# EAGLE design Nikon_PowerBoardV1 (EAGLE 7.3.0)
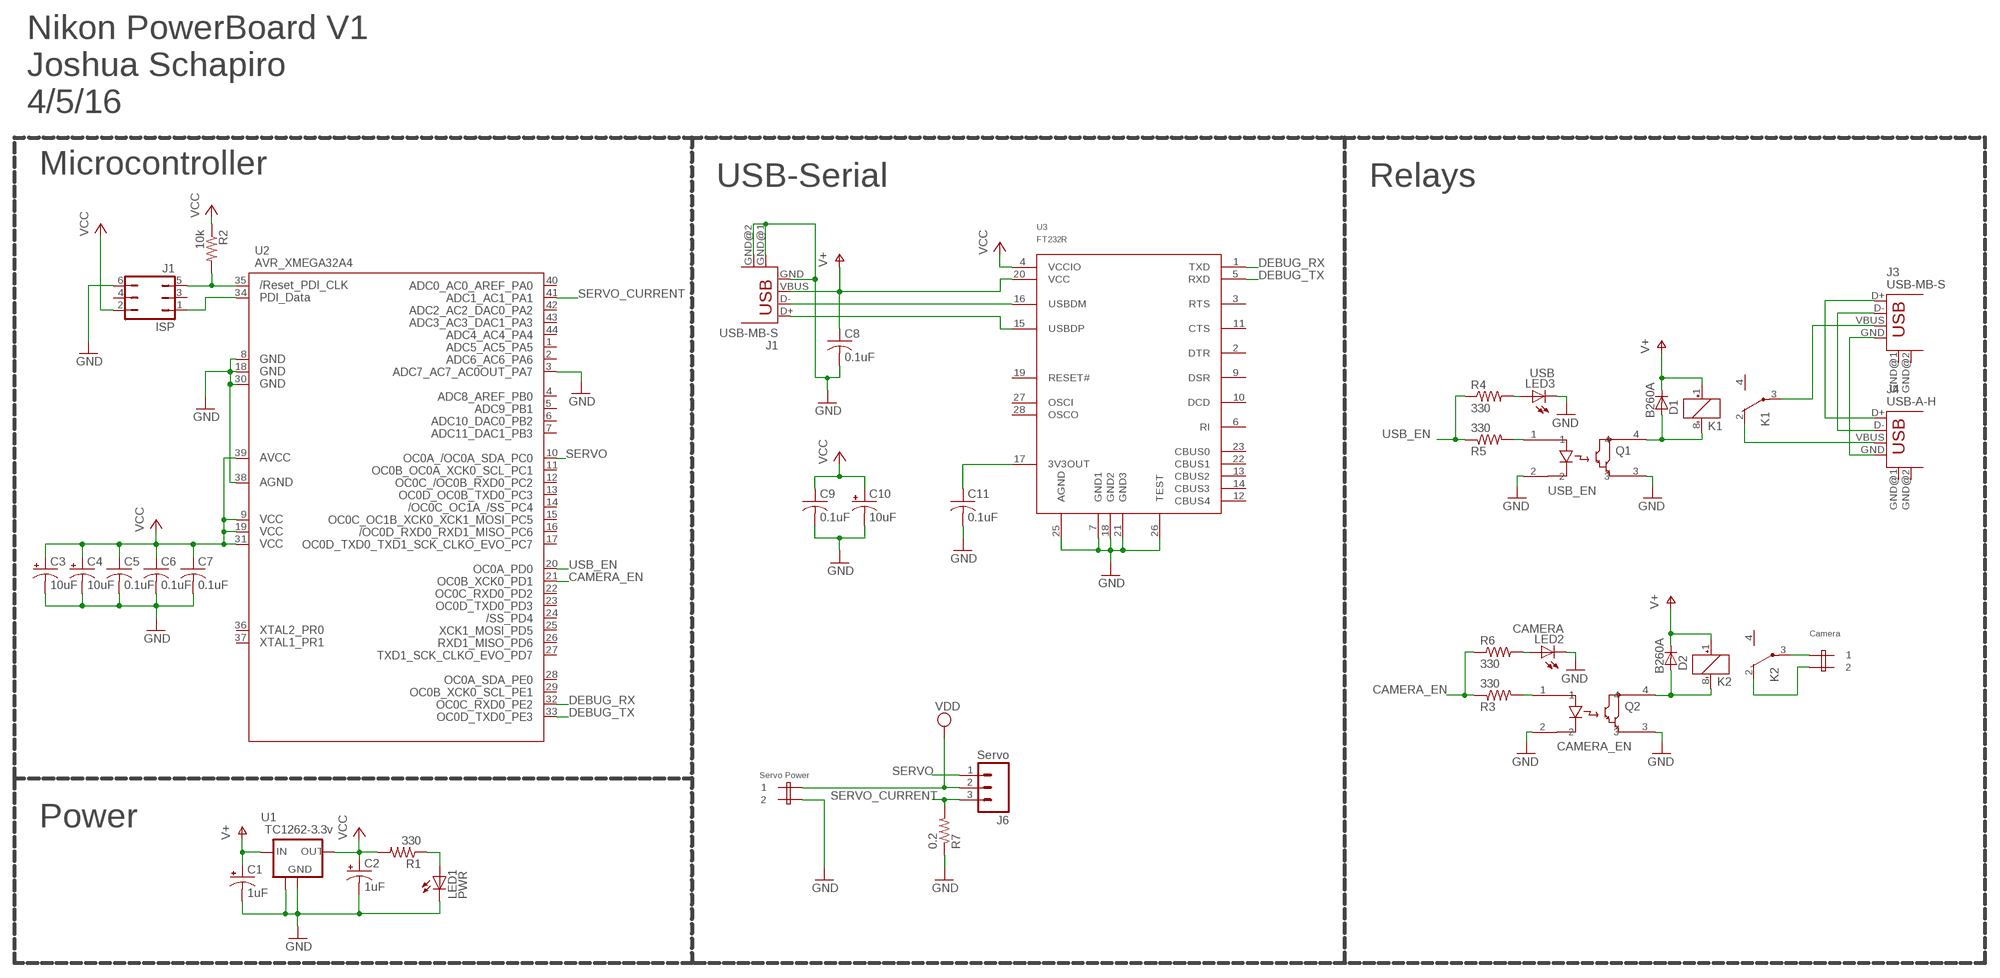
[diagram p0: schematic, sheet 1]

## Parts
C1  1uF  CAP_POL1206  [EIA3216]
C2  1uF  CAP_POL1206  [EIA3216]
C3  10uF  CAP_POL1206  [EIA3216]
C4  10uF  CAP_POL1206  [EIA3216]
C5  0.1uF  C-USC1206  [C1206]
C6  0.1uF  C-USC1206  [C1206]
C7  0.1uF  C-USC1206  [C1206]
C8  0.1uF  C-USC1206  [C1206]
C9  0.1uF  C-USC1206  [C1206]
C10  10uF  CAP_POL1206  [EIA3216]
C11  0.1uF  C-USC1206  [C1206]
D1  B260A  DIODESMA  [SMA-DIODE]
D2  B260A  DIODESMA  [SMA-DIODE]
ISP  J1  JP3Q  [JP3Q]
J1  USB-MB-S  [USB-MB-S]
J2  Camera  2-PIN_SCREWTERMINAL  [2-PIN_SCREWTERM]
J3  USB-MB-S  [USB-MB-S]
J4  USB-A-H  [USB-A-H]
J5  ServoPower  2-PIN_SCREWTERMINAL  [2-PIN_SCREWTERM]
J6  Servo  M03LONGPADS  [1X03_LONGPADS]
K1  USB_EN  G6K-2F  [G6K-2F]
K2  CAMERA_EN  G6K-2F  [G6K-2F]
LED1  PWR  LEDCHIPLED_1206  [CHIPLED_1206]
LED2  CAMERA  LEDCHIPLED_1206  [CHIPLED_1206]
LED3  USB  LEDCHIPLED_1206  [CHIPLED_1206]
Q1  USB_EN  OPTOISOLATOR_SINGLE  [4-PIN_MINI-FLAT]
Q2  CAMERA_EN  OPTOISOLATOR_SINGLE  [4-PIN_MINI-FLAT]
R1  330  R-US_R1206  [R1206]
R2  10k  R-US_R1206  [R1206]
R3  330  R-US_R1206  [R1206]
R4  330  R-US_R1206  [R1206]
R5  330  R-US_R1206  [R1206]
R6  330  R-US_R1206  [R1206]
R7  0.2  R-US_R1206  [R1206]
U1  TC1262-3.3v  REGULATOR  [SOT223]
U2  AVR_XMEGA32A4  AVR_XMEGA_A4_44A  [TQFP44]
U3  FT232R  [SSOP28]

## Nets
CAMERA_EN: R3.1 R6.1 U2.21(PD1)
DEBUG_RX: U2.32(PE2) U3.1(TXD)
DEBUG_TX: U2.33(PE3) U3.5(RXD)
GND: C1.C(-) C2.C(-) C3.C(-) C4.C(-) C5.2 C6.2 C7.2 C8.2 C9.2 C10.C(-) C11.2 ISP.6 J1.GND J1.GND@1(GND) J1.GND@2(GND) J5.P$2 LED1.C LED2.C LED3.C Q1.2 Q1.3 Q2.2 Q2.3 R7.1 U1.2(GND) U1.4(GND1) U2.3(PA7) U2.8(GND1) U2.18(GND2) U2.30(GND3) U2.38(AGND) U3.7(GND1) U3.18(GND2) U3.21(GND3) U3.25(AGND) U3.26(TEST)
J2: J3.D+ J4.D+
N$1: ISP.1 U2.34(PDI_DATA)
N$2: J3.GND J4.GND
N$3: J3.D- J4.D-
N$4: LED1.A R1.1
N$5: Q1.1 R5.2
N$6: ISP.5 R2.2 U2.35(RESET)
N$7: D2.A K2.8(1:-) Q2.4
N$8: J3.VBUS K1.3(2:P)
N$9: J4.VBUS K1.2(2:O)
N$10: LED3.A R4.2
N$11: Q2.1 R3.2
N$12: J1.D- U3.16(USBDM)
N$13: J1.D+ U3.15(USBDP)
N$14: J2.P$1 K2.3(2:P)
N$15: J2.P$2 K2.2(2:O)
N$18: C11.1 U3.17(3V3OUT)
N$19: LED2.A R6.2
N$180: D1.A K1.8(1:-) Q1.4
SERVO: J6.1 U2.10(PC0)
SERVO_CURRENT: J6.3 R7.2 U2.41(PA1)
USB_EN: R4.1 R5.1 U2.20(PD0)
V+: C1.A(+) C8.1 D1.C D2.C J1.VBUS K1.1(1:+) K2.1(1:+) U1.1(IN) U3.20(VCC)
VCC: C2.A(+) C3.A(+) C4.A(+) C5.1 C6.1 C7.1 C9.1 C10.A(+) ISP.2 R1.2 R2.1 U1.3(OUT) U2.9(VCC1) U2.19(VCC2) U2.31(VCC3) U2.39(AVCC) U3.4(VCCIO)
VDD: J5.P$1 J6.2
Unconnected: ISP.3 ISP.4 J3.GND@1(GND) J3.GND@2(GND) J4.GND@1(GND) J4.GND@2(GND) K1.4(2:S) K1.5(3:S) K1.6(3:P) K1.7(3:O) K2.4(2:S) K2.5(3:S) K2.6(3:P) K2.7(3:O) U2.1(PA5) U2.2(PA6) U2.4(PB0) U2.5(PB1) U2.6(PB2) U2.7(PB3) U2.11(PC1) U2.12(PC2) U2.13(PC3) U2.14(PC4) U2.15(PC5) U2.16(PC6) U2.17(PC7) U2.22(PD2) U2.23(PD3) U2.24(PD4) U2.25(PD5) U2.26(PD6) U2.27(PD7) U2.28(PE0) U2.29(PE1) U2.36(PR0) U2.37(PR1) U2.40(PA0) U2.42(PA2) U2.43(PA3) U2.44(PA4) U3.2(DTR) U3.3(RTS) U3.6(RI) U3.9(DSR) U3.10(DCD) U3.11(CTS) U3.12(CBUS4) U3.13(CBUS2) U3.14(CBUS3) U3.19(RESET#) U3.22(CBUS1) U3.23(CBUS0) U3.27(OSCI) U3.28(OSCO)

## Notes on the sheet
- Nikon PowerBoard V1
  Joshua Schapiro
  4/5/16
- Microcontroller
- USB-Serial | Relays
- Camera
- Servo Power
- Power

## Library data of the parts
C1-C4 C10 = SparkFun:CAP_POL: Capacitor Polarized These are standard SMD and PTH capacitors. Normally 10uF, 47uF, and 100uF in electrolytic and tantalum varieties. Always verify the external diameter of the through hole cap, it varies with capacity, voltage, and manufacturer. The EIA devices should be standard.
C5-C9 C11 = resistor:C-US: CAPACITOR, American symbol
D1 D2 = SparkFun:DIODE: Diode These are standard reverse protection diodes and small signal diodes. SMA package can handle up to about 1A. SOD-323 can handle about 200mA. What the SOD-323 package when ordering, there are some mfgs out there that are 5-pin packages.
ISP = jumper:JP3Q: JUMPER
J1 J3 J4 = GadgetOne:USB: USB Connectors
J2 J5 = Josh:2-PIN_SCREWTERMINAL
J6 = SparkFun:M03: Header 3 Standard 3-pin 0.1" header. Use with straight break away headers (SKU : PRT-00116), right angle break away headers (PRT-00553), swiss pins (PRT-00743), machine pins (PRT-00117), and female headers (PRT-00115). Molex polarized connector foot print use with SKU : PRT-08232 with associated crimp pins and housings.
K1 K2 = relay:G6K: Low Signal Relay oeiwcsnts1.omron.com/.. D20G6K0100.pdf
LED1-LED3 = led:LED: LED OSRAM: - CHIPLED LG R971, LG N971, LY N971, LG Q971, LY Q971, LO R971, LY R971 LH N974, LH R974 LS Q976, LO Q976, LY Q976 LO Q996 - Hyper CHIPLED LW Q18S LB Q993, LB Q99A, LB R99A - SideLED LS A670, LO A670, LY A670, LG A670, LP A670 LB A673, LV A673, LT A673, LW A673 LH A674 LY A675 LS A676, LA A676, LO A676, LY A676, LW A676 LS A679, LY A679, LG A679 - Hyper Micro SIDELED® LS Y876, LA Y876, LO Y876, LY Y876 LT Y87S - SmartLED LW L88C, LW L88S LB L89C, LB L89S, LG L890 LS L89K, LO L89K, LY L89K LS L896, LA L896, LO L896, LY L896 - TOPLED LS T670, LO T670, LY T670, LG T670, LP T670 LSG T670, LSP T670, LSY T670, LOP T670, LYG T670 LG T671, LOG T671, LSG T671 LB T673, LV T673, LT T673, LW T673 LH T674 LS T676, LA T676, LO T676, LY T676, LB T676, LH T676, LSB T676, LW T676 LB T67C, LV T67C, LT T67C, LS T67K, LO T67K, LY T67K, LW E67C LS E67B, LA E67B, LO E67B, LY E67B, LB E67C, LV E67C, LT E67C LW T67C LS T679, LY T679, LG T679 LS T770, LO T770, LY T770, LG T770, LP T770 LB T773, LV T773, LT T773, LW T773 LH T774 LS E675, LA E675, LY E675, LS T675 LS T776, LA T776, LO T776, LY T776, LB T776 LHGB T686 LT T68C, LB T68C - Hyper Mini TOPLED® LB M676 - Mini TOPLED Santana® LG M470 LS M47K, LO M47K, LY M47K Source: http://www.osram.convergy.de LUXEON: - LUMILED® LXK2-PW12-R00, LXK2-PW12-S00, LXK2-PW14-U00, LXK2-PW14-V00 LXK2-PM12-R00, LXK2-PM12-S00, LXK2-PM14-U00 LXK2-PE12-Q00, LXK2-PE12-R00, LXK2-PE12-S00, LXK2-PE14-T00, LXK2-PE14-U00 LXK2-PB12-K00, LXK2-PB12-L00, LXK2-PB12-M00, LXK2-PB14-N00, LXK2-PB14-P00, LXK2-PB14-Q00 LXK2-PR12-L00, LXK2-PR12-M00, LXK2-PR14-Q00, LXK2-PR14-R00 LXK2-PD12-Q00, LXK2-PD12-R00, LXK2-PD12-S00 LXK2-PH12-R00, LXK2-PH12-S00 LXK2-PL12-P00, LXK2-PL12-Q00, LXK2-PL12-R00 Source: www.luxeon.com KINGBRIGHT: KA-3528ASYC Source: www.kingbright.com
Q1 Q2 = Josh:OPTOISOLATOR_SINGLE: Digikey: 425-2098-1-ND If = 10ma Ic = 80ma
R1-R7 = resistor:R-US_: RESISTOR, American symbol
U1 = GadgetOne:REGULATOR: VOLTAGE REGULATOR, see: http://focus.ti.com/lit/ds/symlink/ua78m05.pdf
U2 = xmega:AVR_XMEGA_A4_: Device for Atmel AVR XMEGA A4 Series
U3 = gadgetry:FT232R

## Net classes
4 xxwide: width 0.203 mm

## Board
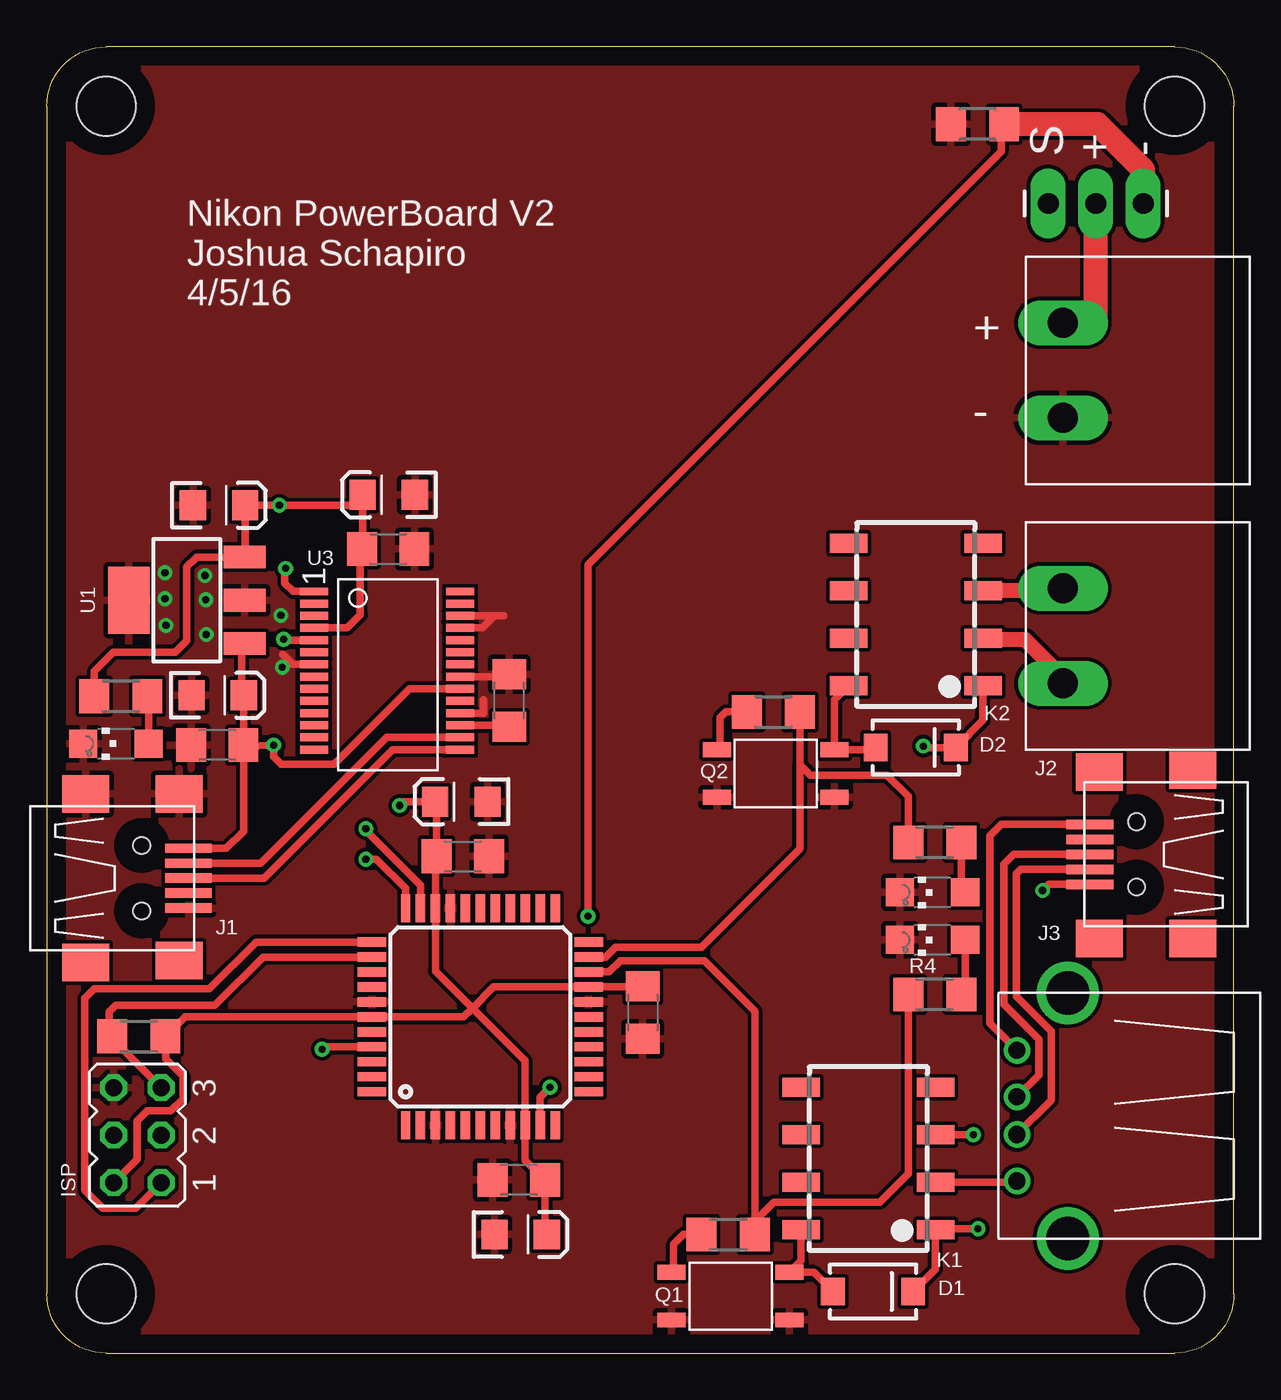
[diagram p1: board, top side]
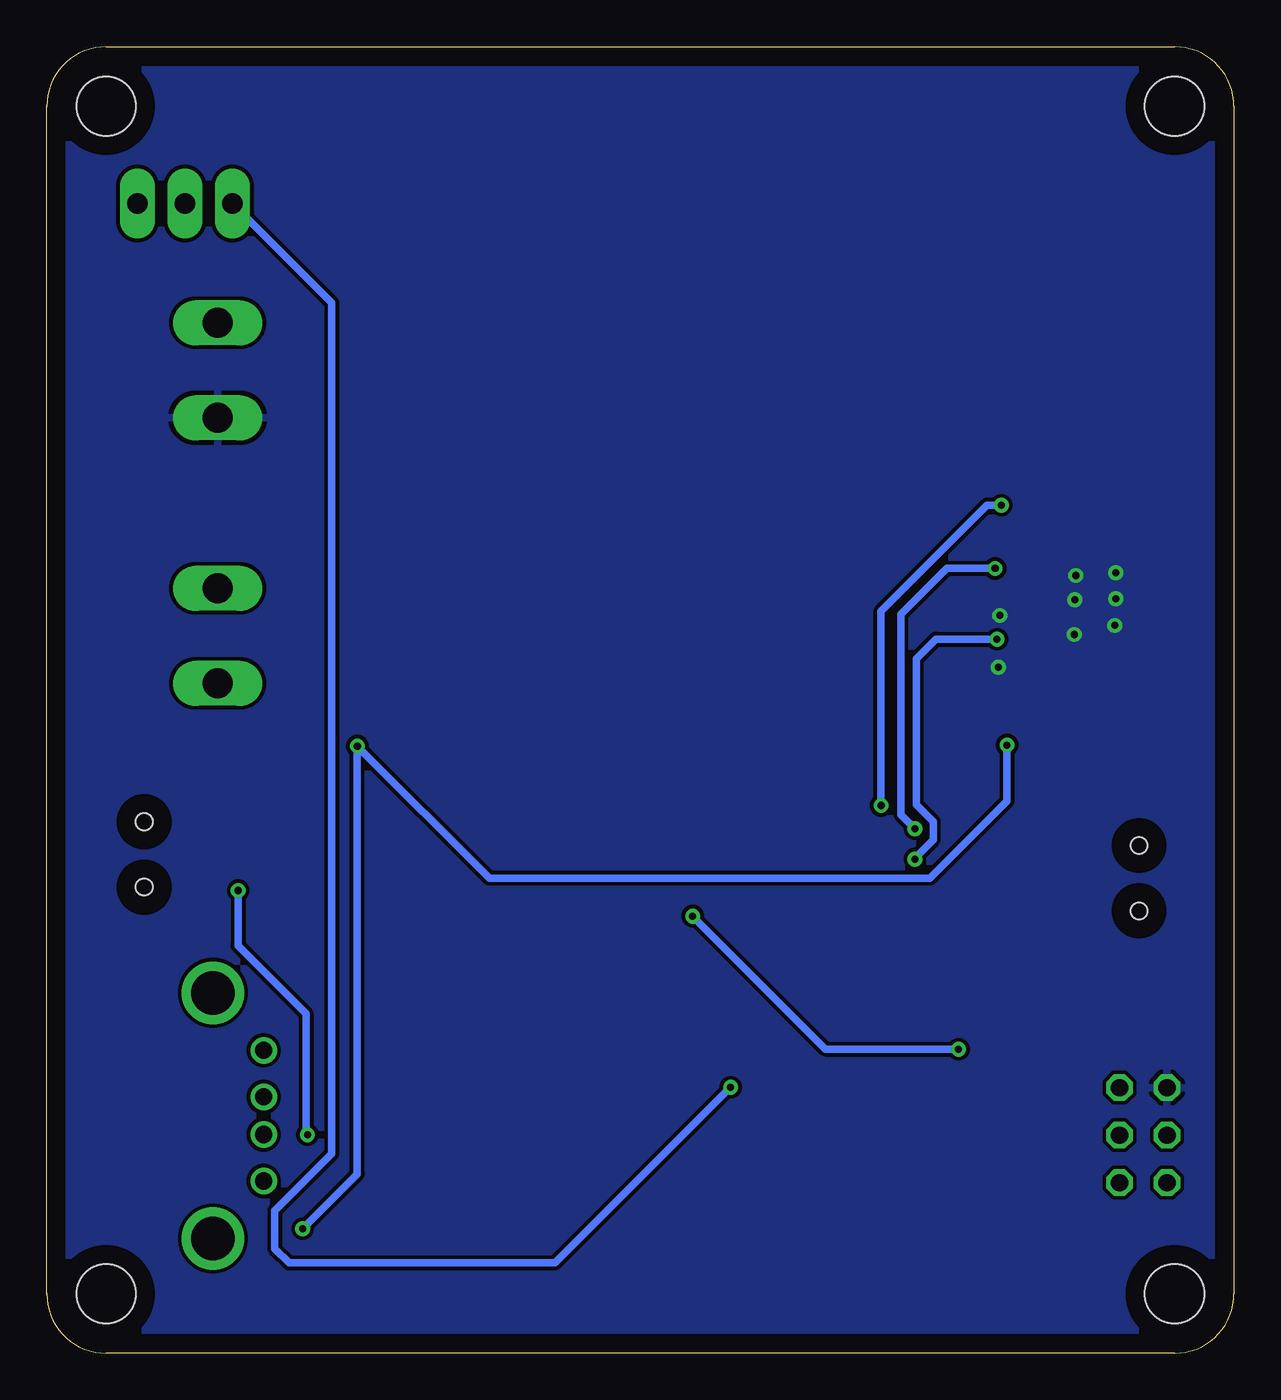
[diagram p2: board, bottom side, seen from below]

Size 63.5 x 69.85 mm. Coordinates in mm from the lower left corner, seen from the top.
Outline: 3.17,0 60.33,0 arc90 63.5,3.17 63.5,66.67 arc90 60.33,69.85 3.17,69.85 arc90 0,66.67 0,3.17 arc90 3.17,0
Copper layers (1*16): Top 0.035mm / dielectric 1.5mm / Bottom 0.035mm
Design rules "default *": minimum track width 10mil, minimum drill 15mil, track to track 8mil, track to pad 8mil, pad to pad 8mil, via to via 8mil, smd to smd 8mil, copper to edge 40mil, drill to drill 8mil, minimum pad ring 10mil, minimum via ring 8mil, stop-mask expansion 4mil, vias tented up to drill 0mil, thermal gap 10mil
Holes 3.17 mm at 3.17,66.67 60.33,66.67 60.33,3.17 3.17,3.17
tRestrict: area 13.3,31.9 to 15.2,41.1; area 21.2,31.9 to 23,41.1

### Footprints (pad centres in the part's own frame; a part is rotated, then mirrored left to right if it is on the bottom)
EIA3216 = smd 1.4 x 1.6: A 1.4,0; C -1.4,0
C1206 = smd 1.6 x 1.8: 1 -1.4,0; 2 1.4,0
SMA-DIODE = smd 1.27 x 1.47: A -2.15,0; C 2.15,0
JP3Q = drill 0.914 octagon: 1 -2.54,-1.27; 2 -2.54,1.27; 3 0,-1.27; 4 0,1.27; 5 2.54,-1.27; 6 2.54,1.27
USB-MB-S = smd 2.5 x 0.5: D+ 2.5,0; D- 2.5,0.8; GND 2.5,-1.6; ID 2.5,-0.8; VBUS 2.5,1.6 | smd 2.5 x 2: GND@1 -3,4.5; GND@2 2,4.5; GND@3 -3,-4.5; GND@4 2,-4.4 | hole 0.9: 0,1.75; 0,-1.75
2-PIN_SCREWTERM = drill 1.6 long: P$1 -2.54,0; P$2 2.54,0
USB-A-H = drill 0.914: D+ 2.718,-1.003; D- 2.718,1.003; GND 2.718,-3.493; VBUS 2.718,3.493 | drill 2.311: GND@1 0,6.566; GND@2 0,-6.566
1X03_LONGPADS = drill 1.118 pad 1.88 long: 1 0,0; 2 2.54,0; 3 5.08,0
G6K-2F = smd 1 x 2: 1 -3.81,-3.6; 2 -1.27,-3.6; 3 1.27,-3.6; 4 3.81,-3.6; 5 3.81,3.6; 6 1.27,3.6; 7 -1.27,3.6; 8 -3.81,3.6
CHIPLED_1206 = smd 1.5 x 1.5: A 0,-1.75; C 0,1.75
4-PIN_MINI-FLAT = smd 1.5 x 0.8: 1 -3.15,1.27; 2 -3.15,-1.27; 3 3.15,-1.27; 4 3.15,1.27
R1206 = smd 1.6 x 1.803: 1 -1.422,0; 2 1.422,0
SOT223 = smd 1.219 x 2.235: 1 -2.311,-3.099; 2 0,-3.099; 3 2.311,-3.099 | smd 3.6 x 2.2: 4 0,3.099
TQFP44 = smd 1.5 x 0.5: 1 -5.8,4; 2 -5.8,3.2; 3 -5.8,2.4; 4 -5.8,1.6; 5 -5.8,0.8; 6 -5.8,0; 7 -5.8,-0.8; 8 -5.8,-1.6; 9 -5.8,-2.4; 10 -5.8,-3.2; 11 -5.8,-4; 23 5.8,-4; 24 5.8,-3.2; 25 5.8,-2.4; 26 5.8,-1.6; 27 5.8,-0.8; 28 5.8,0; 29 5.8,0.8; 30 5.8,1.6; 31 5.8,2.4; 32 5.8,3.2; 33 5.8,4 | smd 0.5 x 1.5: 12 -4,-5.8; 13 -3.2,-5.8; 14 -2.4,-5.8; 15 -1.6,-5.8; 16 -0.8,-5.8; 17 0,-5.8; 18 0.8,-5.8; 19 1.6,-5.8; 20 2.4,-5.8; 21 3.2,-5.8; 22 4,-5.8; 34 4,5.8; 35 3.2,5.8; 36 2.4,5.8; 37 1.6,5.8; 38 0.8,5.8; 39 0,5.8; 40 -0.8,5.8; 41 -1.6,5.8; 42 -2.4,5.8; 43 -3.2,5.8; 44 -4,5.8
SSOP28 = smd 0.425 x 1.5: 1 0.65,-1.3; 2 1.3,-1.3; 3 1.95,-1.3; 4 2.6,-1.3; 5 3.25,-1.3; 6 3.9,-1.3; 7 4.55,-1.3; 8 5.2,-1.3; 9 5.85,-1.3; 10 6.5,-1.3; 11 7.15,-1.3; 12 7.8,-1.3; 13 8.45,-1.3; 14 9.1,-1.3; 15 9.1,6.5; 16 8.45,6.5; 17 7.8,6.5; 18 7.15,6.5; 19 6.5,6.5; 20 5.85,6.5; 21 5.2,6.5; 22 4.55,6.5; 23 3.9,6.5; 24 3.25,6.5; 25 2.6,6.5; 26 1.95,6.5; 27 1.3,6.5; 28 0.65,6.5

### Placement (x,y rotation side)
C1  9.14,35.18 0 top
C2  9.22,45.34 0 top
C3  25.35,6.35 0 top
C4  22.17,29.49 180 top
C5  31.88,18.21 270 top
C6  22.25,26.57 0 top
C7  25.25,9.27 180 top
C8  9.12,32.51 180 top
C9  18.26,43 0 top
C10  18.29,45.9 180 top
C11  24.74,34.9 90 top
D1  44.2,3.3 0 top
D2  46.48,32.38 0 top
ISP  4.85,11.66 90 top
J1  5.08,25.4 0 top
J2  54.36,38.35 270 top
J3  58.29,26.67 180 top
J4  54.61,12.7 180 top
J5  54.36,52.55 270 top
J6  53.57,61.47 0 top
K1  43.94,10.41 90 top
K2  46.48,39.5 90 top
LED1  3.71,32.59 90 top
LED2  47.37,24.64 90 top
LED3  47.37,22.1 90 top
Q1  36.58,3.05 0 top
Q2  38.99,30.99 0 top
R1  3.96,35.13 180 top
R2  4.93,16.94 180 top
R3  38.86,34.29 180 top
R4  47.5,19.18 0 top
R5  36.45,6.35 180 top
R6  47.5,27.3 0 top
R7  49.78,65.71 0 top
U1  7.49,40.26 90 top
U2  23.19,17.98 90 top
U3  15.6,41.38 270 top

### Tracks (layer width: path | path; a pad name or v marks a point on that pad's centre or on a via)
CAMERA_EN
  Top 0.406: R3.1 | R3.1 40.28,31.47 | 40.28,31.47 40.84,30.91 44.93,30.91 46.08,29.77 R6.1 | U2.21 29.89,21.18 30.43,21.72 35.03,21.72 40.28,26.98 40.28,31.47
DEBUG_RX  (via drill 0.38)
  Top 0.406: U2.32 19.99,25.02 17.07,27.94 v17.07,28.04 | v12.78,41.96 12.72,41.91 12.72,41.17 13.17,40.73 U3.1
  Bottom 0.406: v17.07,28.04 17.8,28.78 17.8,39.52 15.37,41.96 v12.78,41.96
DEBUG_TX  (via drill 0.38)
  Top 0.406: U2.33 19.19,24.85 17.63,26.42 v17.07,26.42 | v12.68,38.18 12.72,38.13 U3.5
  Bottom 0.406: v17.07,26.42 17.07,26.47 16.08,27.46 16.08,28.42 16.99,29.34 16.99,37.13 15.95,38.18 v12.68,38.18
GND  (via drill 0.38)
  Top 0.406: U3.7 13.16,36.83 12.62,37.36 | U3.21 24.62,36.18 C11.2 | U3.26 23.95,39.43 | 23.95,39.43 24.43,39.43 24.43,39.42 | U3.25 23.3,38.78 23.95,39.43 | U3.18 23.37,34.23 23.37,34.92
  other vias: 6.32,40.34 8.51,40.28 8.46,41.58 6.32,41.73 6.38,38.91 8.53,38.43 12.52,39.45 12.6,36.68
  pour Bottom: 0,0 63.5,0 63.5,69.85 0,69.85
  pour Top: 0,69.85 63.5,69.85 63.5,0 0,0
J2
  Top 0.406: J3.D+ 51.71,26.67 51.18,26.14 51.18,18.67 53.06,16.79 53.06,14.87 J4.D+
N$1
  Top 0.406: U2.34 11.19,21.98 8.69,19.48 2.54,19.48 2.03,18.97 2.03,8.71 3,7.75 4.75,7.75 ISP.1
N$2
  Top 0.406: J3.GND 51.05,28.27 50.44,27.66 50.44,17.64 J4.GND
N$3
  Top 0.406: J3.D- 52.11,25.87 51.87,25.63 51.87,19.07 53.72,17.22 53.72,13.53 J4.D-
N$4
  Top 0.406: R1.1 5.46,35.05 LED1.A
N$5
  Top 0.406: Q1.1 33.53,4.42 33.53,5.82 34.06,6.35 R5.2
N$6
  Top 0.406: U2.35 11.58,21.18 8.99,18.59 3.68,18.59 3.35,18.26 3.35,17.09 R2.2 3.51,16.81 ISP.5
N$7
  Top 0.406: D2.A 44.2,32.26 Q2.4 42.14,34.94 K2.8
N$8  (via drill 0.38)
  Top 0.406: J3.VBUS 53.59,25.07 v53.26,24.74 | v49.55,11.68 K1.3
  Bottom 0.406: v53.26,24.74 53.26,21.79 49.63,18.16 49.63,11.76 v49.55,11.68
N$9
  Top 0.406: K1.2 51.83,9.14 J4.VBUS
N$10
  Top 0.406: R4.2 49.12,19.38 LED3.A
N$11
  Top 0.406: Q2.1 36.02,32.44 36.02,33.98 36.32,34.29 R3.2
N$12
  Top 0.406: U3.16 18.17,32.93 11.44,26.2 J1.D-
N$13
  Top 0.406: U3.15 18.51,32.28 11.63,25.4 J1.D+
N$14
  Top 0.813: J2.P$1 54.23,40.77 K2.3
N$15
  Top 0.813: J2.P$2 54.36,36.14 52.35,38.15 50.16,38.15 K2.2
N$18
  Top 0.406: U3.17 24.66,33.58 C11.1
N$19
  Top 0.406: LED2.A 48.92,24.84 R6.2
N$180
  Top 0.406: D1.A 41.03,4.32 Q1.4 40.34,4.93 K1.8
SERVO  (via drill 0.38)
  Top 0.406: v26.92,14.22 26.39,13.69 U2.10
  Bottom 0.406: J6.1 48.26,56.16 48.26,10.67 51.31,7.62 51.31,5.59 50.55,4.83 36.32,4.83 v26.92,14.22
SERVO_CURRENT  (via drill 0.38)
  Top 0.406: R7.2 51.05,65.56 51.05,64.26 28.96,42.16 v28.96,23.37 | v14.73,16.26 14.86,16.38 U2.41
  Top 1.27: J6.3 58.65,63.27 56.21,65.71 R7.2
  Bottom 0.406: v28.96,23.37 21.84,16.26 v14.73,16.26
USB_EN
  Top 0.406: R4.1 46.08,9.6 44.55,8.08 38.89,8.08 37.87,7.06 R5.1 37.87,18.29 35.18,20.98 30.68,20.98 30.09,20.38 U2.20
V+  (via drill 0.38)
  Top 0.406: J1.VBUS 9.6,27 10.52,27.92 C8.1 10.54,32.54 | 10.54,32.54 C1.A 10.41,35.31 10.41,37.95 U1.1 | D1.C 47.54,4.5 K1.1 47.59,6.66 v49.81,6.66 | K2.1 50.08,33.84 D2.C 46.97,32.38 v46.89,32.46 | 10.54,32.54 10.62,32.46 v12.14,32.51 12.14,31.9 12.55,31.5 15.37,31.5 19.4,35.53 U3.20
  Bottom 0.406: v49.81,6.66 46.89,9.58 v46.89,32.46 39.83,25.4 16.26,25.4 12.14,29.52 v12.14,32.51
VCC  (via drill 0.38)
  Top 0.406: R1.2 2.54,36.45 3.56,37.47 6.86,37.47 7.49,38.1 7.49,42.04 8.03,42.57 U1.3 10.62,42.57 C2.A v12.45,45.34 16.89,45.34 C10.A 16.89,43.03 C9.1 | C9.1 17.05,42.81 | 22.77,18.45 20.79,20.43 U2.31 20.79,26.51 C6.1 20.85,29.41 C4.A 19.07,29.49 v18.87,29.29 | 22.77,18.45 25.59,15.63 U2.9 25.59,10.33 C7.1 26.65,6.45 C3.A | 22.77,18.45 22.3,17.98 U2.39 7.39,17.98 R2.1 6.35,15.75 7.29,14.81 7.29,13.61 6.63,12.95 5.36,12.95 4.83,12.42 4.83,10.36 ISP.2 | 22.77,18.45 23.9,19.58 U2.19 31.85,19.58 C5.1 | U3.4 16.07,38.78 16.76,39.47 16.76,42.9 C9.1
  Bottom 0.406: v18.87,29.29 18.87,39.67 13.21,45.34 v12.45,45.34
VDD
  Top 1.27: J5.P$1 56.11,55.09 J6.2

### Text on the board
tPlace: S | + | - | + | -
tNames: Nikon PowerBoard V2 / Joshua Schapiro / 4/5/16